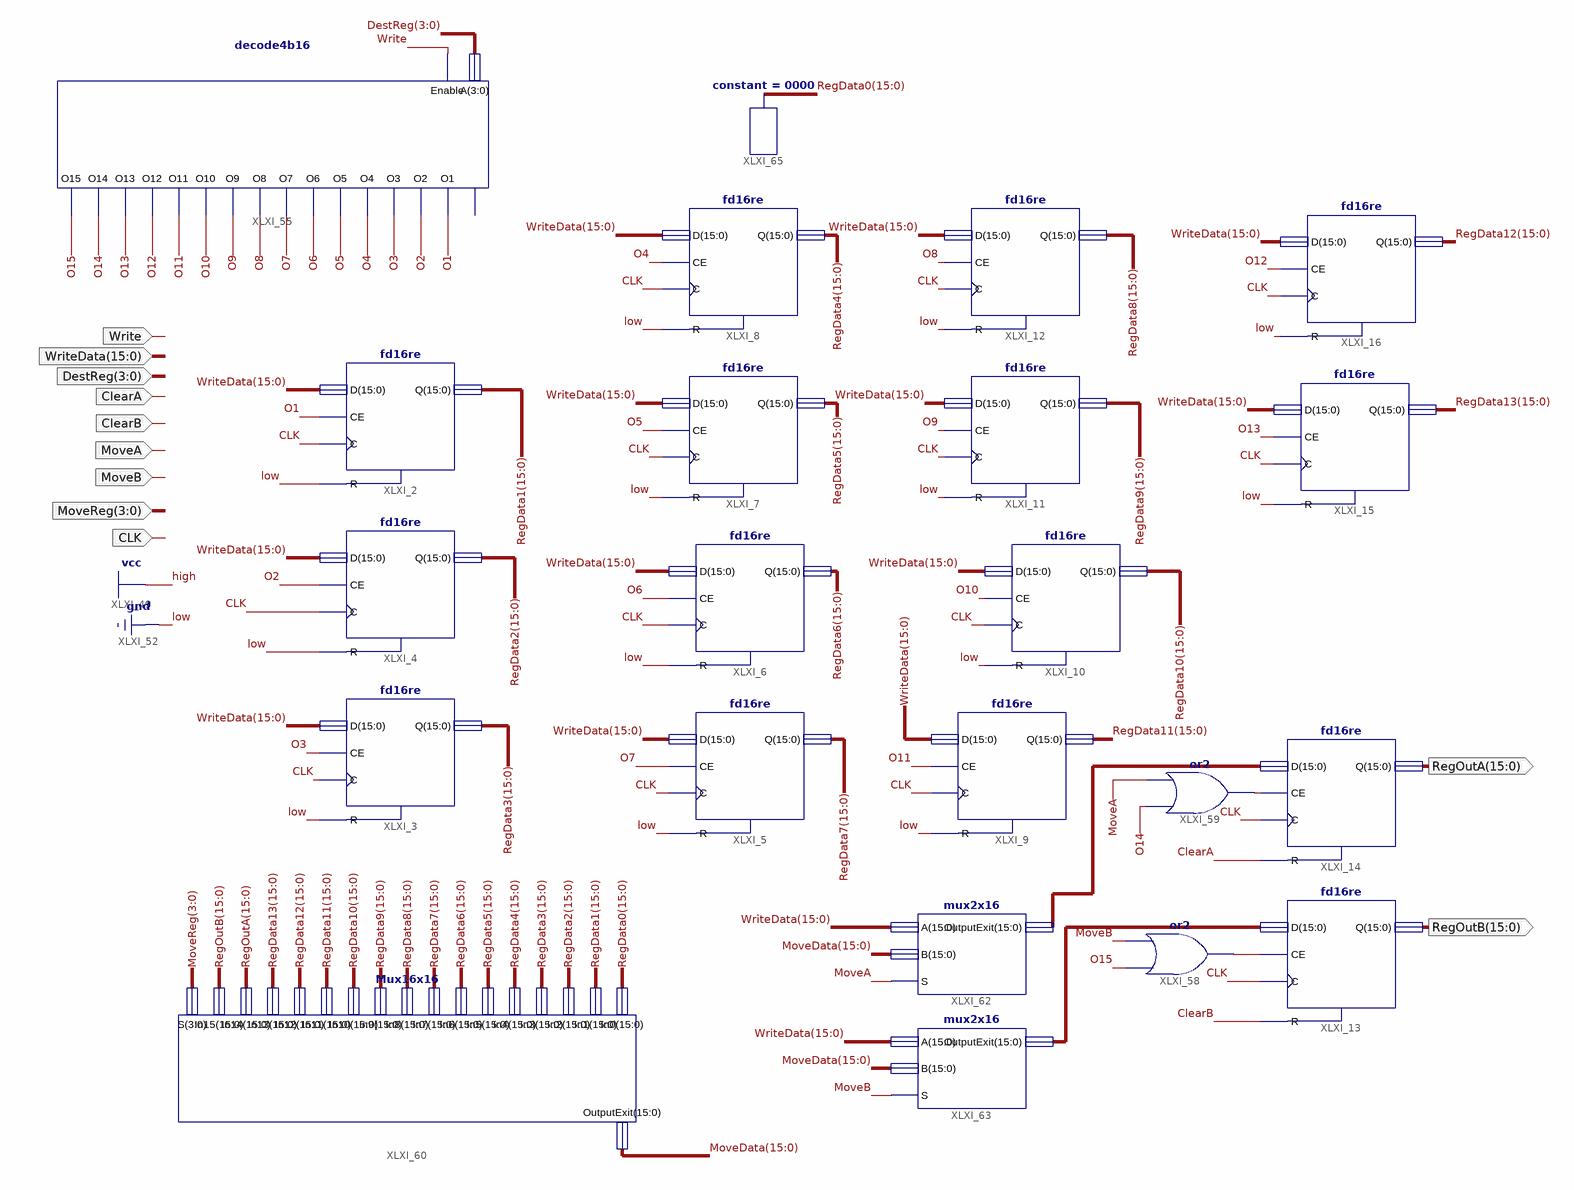
[diagram p0: schematic sheet 1]
// Xilinx ISE schematic regFile.sch (spartan3e) as structural Verilog: 22 symbols, 11 ports
module regFile (
  input  ClearA,
  input  ClearB,
  input  MoveA,
  input  MoveB,
  input  CLK,
  input  Write,
  input  [3:0] DestReg,
  input  [3:0] MoveReg,
  input  [15:0] WriteData,
  output [15:0] RegOutA,
  output [15:0] RegOutB
);

  wire O1, O2, O3, O4, O5, O6, O7, O8, O9, O10, O11, O12, O13, O14, O15, XLXN_66, XLXN_67;
  wire [15:0] MoveData, RegData0, RegData1, RegData2, RegData3, RegData4, RegData5, RegData6, RegData7,
       RegData8, RegData9, RegData10, RegData11, RegData12, RegData13, XLXN_59, XLXN_60;

  fd16re XLXI_13 (.C(CLK), .CE(XLXN_66), .D(XLXN_60), .R(ClearB), .Q(RegOutB));
  fd16re XLXI_14 (.C(CLK), .CE(XLXN_67), .D(XLXN_59), .R(ClearA), .Q(RegOutA));
  fd16re XLXI_15 (.C(CLK), .CE(O13), .D(WriteData), .R(1'b0), .Q(RegData13));
  fd16re XLXI_16 (.C(CLK), .CE(O12), .D(WriteData), .R(1'b0), .Q(RegData12));
  fd16re XLXI_12 (.C(CLK), .CE(O8), .D(WriteData), .R(1'b0), .Q(RegData8));
  fd16re XLXI_11 (.C(CLK), .CE(O9), .D(WriteData), .R(1'b0), .Q(RegData9));
  fd16re XLXI_10 (.C(CLK), .CE(O10), .D(WriteData), .R(1'b0), .Q(RegData10));
  fd16re XLXI_7 (.C(CLK), .CE(O5), .D(WriteData), .R(1'b0), .Q(RegData5));
  fd16re XLXI_8 (.C(CLK), .CE(O4), .D(WriteData), .R(1'b0), .Q(RegData4));
  fd16re XLXI_6 (.C(CLK), .CE(O6), .D(WriteData), .R(1'b0), .Q(RegData6));
  fd16re XLXI_2 (.C(CLK), .CE(O1), .D(WriteData), .R(1'b0), .Q(RegData1));
  fd16re XLXI_3 (.C(CLK), .CE(O3), .D(WriteData), .R(1'b0), .Q(RegData3));
  fd16re XLXI_4 (.C(CLK), .CE(O2), .D(WriteData), .R(1'b0), .Q(RegData2));
  fd16re XLXI_5 (.C(CLK), .CE(O7), .D(WriteData), .R(1'b0), .Q(RegData7));
  fd16re XLXI_9 (.C(CLK), .CE(O11), .D(WriteData), .R(1'b0), .Q(RegData11));
  decode4b16 XLXI_55 (
    .A(DestReg), .Enable(Write), .O1(O1), .O2(O2), .O3(O3), .O5(O5), .O6(O6), .O15(O15), .O14(O14),
    .O11(O11), .O9(O9), .O8(O8), .O4(O4), .O12(O12), .O10(O10), .O7(O7), .O13(O13));  // open: O0
  or XLXI_58 (XLXN_66, O15, MoveB);
  or XLXI_59 (XLXN_67, O14, MoveA);
  Mux16x16 XLXI_60 (
    .In0(RegData0), .In1(RegData1), .In10(RegData10), .In11(RegData11), .In12(RegData12), .In13(RegData13),
    .In14(RegOutA), .In15(RegOutB), .In2(RegData2), .In3(RegData3), .In4(RegData4), .In5(RegData5),
    .In6(RegData6), .In7(RegData7), .In8(RegData8), .In9(RegData9), .OutputExit(MoveData), .S(MoveReg));
  mux2x16 XLXI_62 (.A(WriteData), .B(MoveData), .S(MoveA), .OutputExit(XLXN_59));
  mux2x16 XLXI_63 (.A(WriteData), .B(MoveData), .S(MoveB), .OutputExit(XLXN_60));
  constant #(.CValue("0000")) XLXI_65 (.O(RegData0));
endmodule
